# EAGLE schematic RoboSim_top_level (EAGLE 7.3.0)
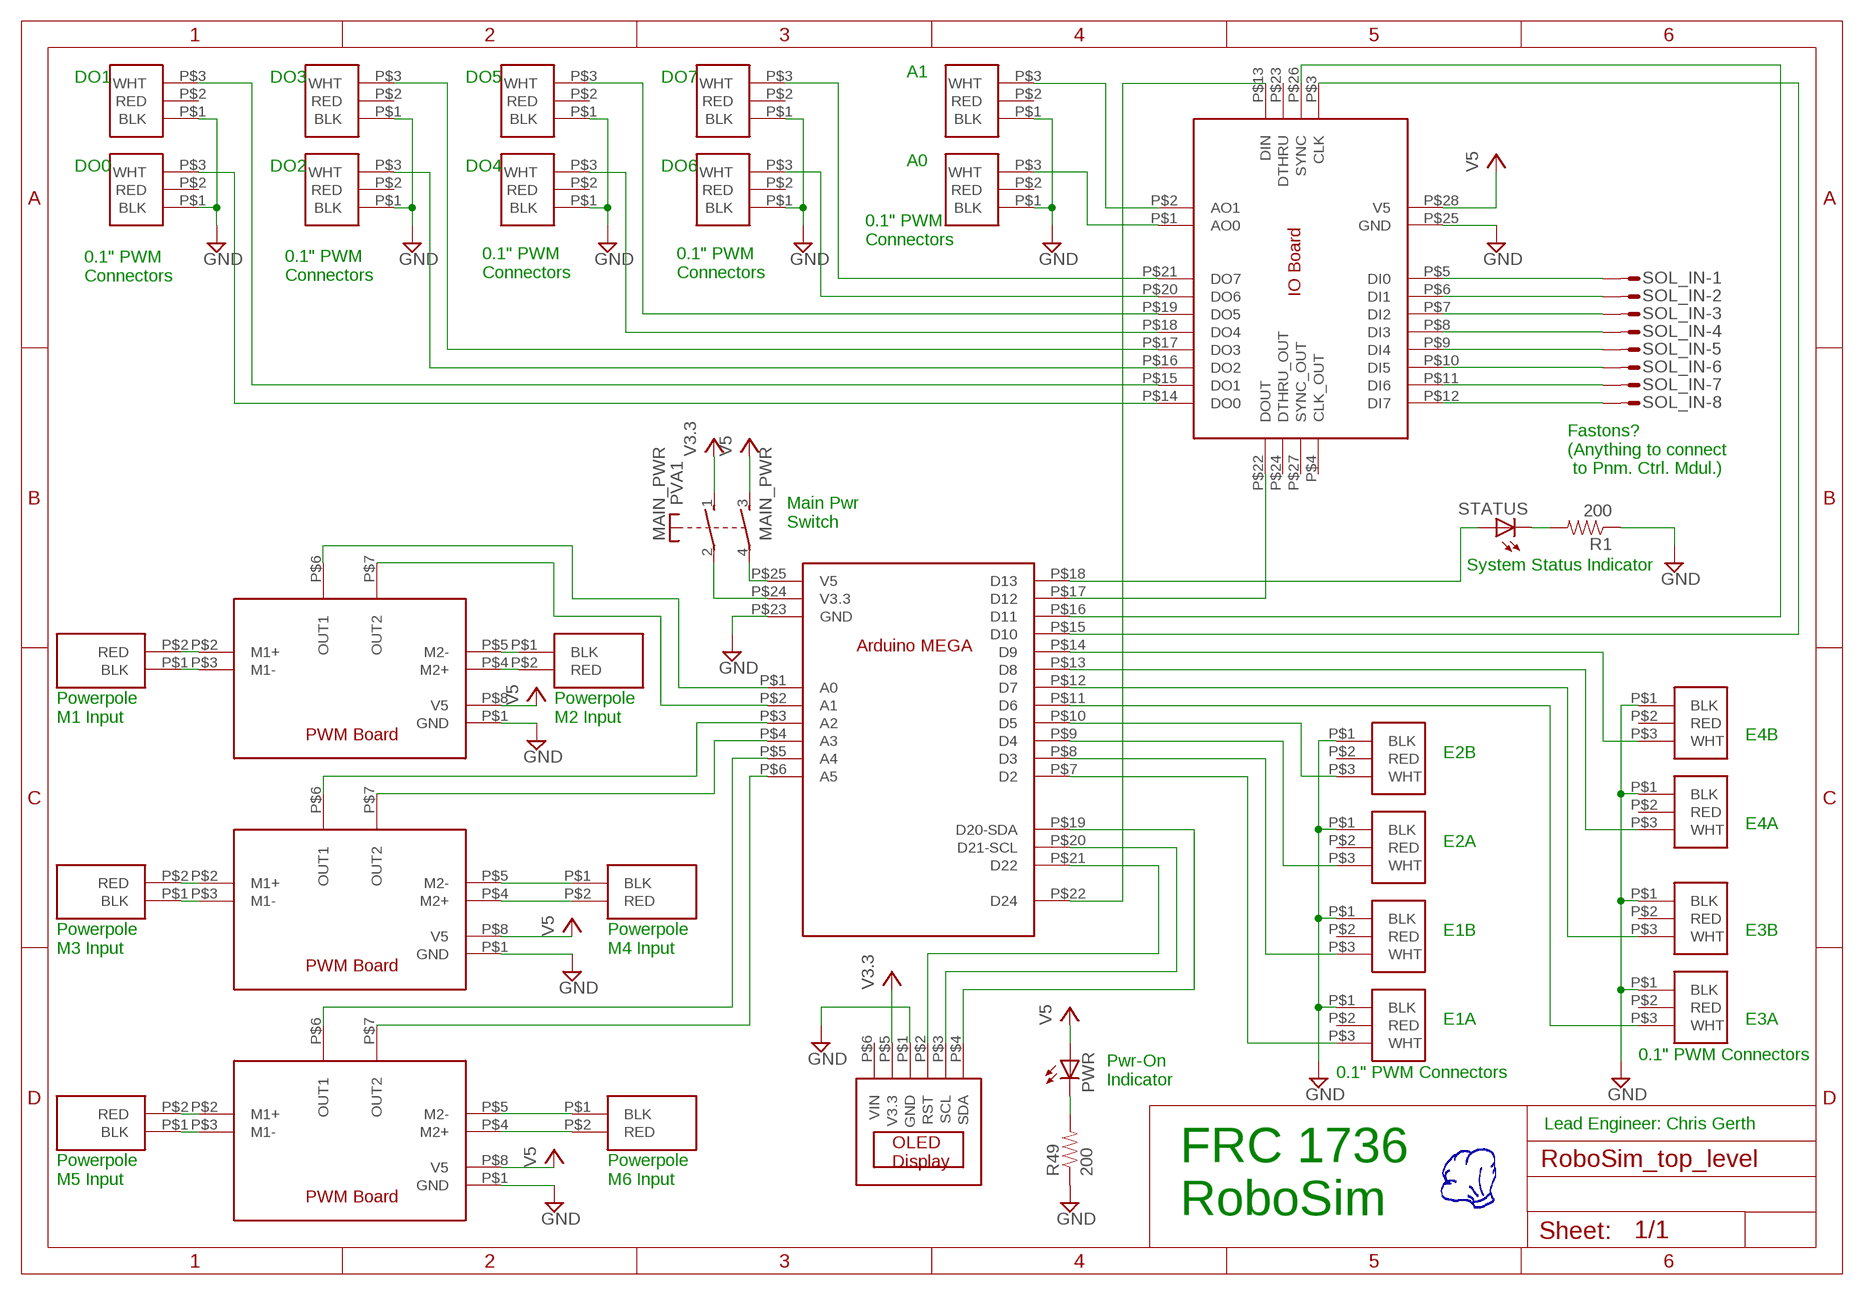
[diagram p0: schematic, sheet 1]

## Parts
MAIN_PWR  PVA1  [PVA1F]
PWR  LED5MM  [LED5MM]
R1  200  RESISTORPTH-1/4W-VERT  [AXIAL-0.1]
R49  200  RESISTORPTH-1/4W-VERT  [AXIAL-0.1]
SOL_IN  MT6-8  [MT6-8]
STATUS  LED5MM  [LED5MM]
U$1  ARDUINO_MEGA  [DUMMY]
U$2  DISPLAY  [DUMMY]
U$3  IO_BOARD  [DUMMY]
U$4  PWM_BOARD  [DUMMY]
U$5  PWM_BOARD  [DUMMY]
U$6  PWM_BOARD  [DUMMY]
U$7  POWERPOLE  [DUMMY]
U$8  POWERPOLE  [DUMMY]
U$9  POWERPOLE  [DUMMY]
U$10  POWERPOLE  [DUMMY]
U$11  POWERPOLE  [DUMMY]
U$12  POWERPOLE  [DUMMY]
U$13  PWM_CONN  [DUMMY]
U$14  PWM_CONN  [DUMMY]
U$15  PWM_CONN  [DUMMY]
U$16  PWM_CONN  [DUMMY]
U$17  PWM_CONN  [DUMMY]
U$18  PWM_CONN  [DUMMY]
U$19  PWM_CONN  [DUMMY]
U$20  PWM_CONN  [DUMMY]
U$21  PWM_CONN  [DUMMY]
U$22  PWM_CONN  [DUMMY]
U$23  PWM_CONN  [DUMMY]
U$24  PWM_CONN  [DUMMY]
U$26  PWM_CONN  [DUMMY]
U$27  PWM_CONN  [DUMMY]
U$28  PWM_CONN  [DUMMY]
U$29  PWM_CONN  [DUMMY]
U$30  PWM_CONN  [DUMMY]
U$31  PWM_CONN  [DUMMY]

## Nets
GND: R1.P$1 R49.P$1 U$1.P$23(GND) U$2.P$1(GND) U$3.P$25(GND) U$4.P$1(GND) U$5.P$1(GND) U$6.P$1(GND) U$13.P$1(BLK) U$14.P$1(BLK) U$15.P$1(BLK) U$16.P$1(BLK) U$17.P$1(BLK) U$18.P$1(BLK) U$19.P$1(BLK) U$20.P$1(BLK) U$21.P$1(BLK) U$22.P$1(BLK) U$23.P$1(BLK) U$24.P$1(BLK) U$26.P$1(BLK) U$27.P$1(BLK) U$28.P$1(BLK) U$29.P$1(BLK) U$30.P$1(BLK) U$31.P$1(BLK)
N$1: U$1.P$19(D20-SDA) U$2.P$4(SDA)
N$2: U$1.P$20(D21-SCL) U$2.P$3(SCL)
N$3: U$1.P$21(D22) U$2.P$2(RST)
N$4: MAIN_PWR.4(2:P) U$1.P$25(V5)
N$5: U$1.P$1(A0) U$4.P$6(OUT1)
N$6: MAIN_PWR.2(1:P) U$1.P$24(V3.3)
N$7: U$1.P$2(A1) U$4.P$7(OUT2)
N$8: U$1.P$3(A2) U$5.P$6(OUT1)
N$9: U$1.P$4(A3) U$5.P$7(OUT2)
N$10: U$1.P$5(A4) U$6.P$6(OUT1)
N$11: U$1.P$6(A5) U$6.P$7(OUT2)
N$12: R1.P$2 STATUS.K(C)
N$13: STATUS.A U$1.P$18(D13)
N$14: U$1.P$22(D24) U$3.P$13(DIN)
N$15: U$1.P$17(D12) U$3.P$22(DOUT)
N$16: U$1.P$16(D11) U$3.P$26(SYNC)
N$17: U$1.P$15(D10) U$3.P$3(CLK)
N$18: U$4.P$3(M1-) U$9.P$1(BLK)
N$19: U$4.P$2(M1+) U$9.P$2(RED)
N$20: U$4.P$5(M2-) U$10.P$1(BLK)
N$21: U$4.P$4(M2+) U$10.P$2(RED)
N$22: U$5.P$5(M2-) U$11.P$1(BLK)
N$23: U$5.P$4(M2+) U$11.P$2(RED)
N$24: U$5.P$3(M1-) U$8.P$1(BLK)
N$25: U$5.P$2(M1+) U$8.P$2(RED)
N$26: U$6.P$5(M2-) U$12.P$1(BLK)
N$27: U$6.P$4(M2+) U$12.P$2(RED)
N$28: U$6.P$3(M1-) U$7.P$1(BLK)
N$29: U$6.P$2(M1+) U$7.P$2(RED)
N$30: U$1.P$7(D2) U$17.P$3(WHT)
N$31: U$1.P$8(D3) U$16.P$3(WHT)
N$32: U$1.P$9(D4) U$15.P$3(WHT)
N$33: U$1.P$10(D5) U$14.P$3(WHT)
N$34: U$1.P$11(D6) U$19.P$3(WHT)
N$35: U$1.P$12(D7) U$18.P$3(WHT)
N$36: U$1.P$13(D8) U$20.P$3(WHT)
N$37: U$1.P$14(D9) U$13.P$3(WHT)
N$38: U$3.P$1(AO0) U$21.P$3(WHT)
N$39: U$3.P$21(DO7) U$23.P$3(WHT)
N$40: U$3.P$2(AO1) U$22.P$3(WHT)
N$41: U$3.P$20(DO6) U$24.P$3(WHT)
N$42: U$3.P$19(DO5) U$26.P$3(WHT)
N$43: U$3.P$18(DO4) U$27.P$3(WHT)
N$44: U$3.P$17(DO3) U$28.P$3(WHT)
N$45: U$3.P$16(DO2) U$29.P$3(WHT)
N$46: U$3.P$15(DO1) U$30.P$3(WHT)
N$47: U$3.P$14(DO0) U$31.P$3(WHT)
N$48: SOL_IN.1 U$3.P$5(DI0)
N$49: SOL_IN.2 U$3.P$6(DI1)
N$50: SOL_IN.3 U$3.P$7(DI2)
N$51: SOL_IN.4 U$3.P$8(DI3)
N$52: SOL_IN.5 U$3.P$9(DI4)
N$53: SOL_IN.6 U$3.P$10(DI5)
N$54: SOL_IN.7 U$3.P$11(DI6)
N$55: SOL_IN.8 U$3.P$12(DI7)
N$61: PWR.K(C) R49.P$2
VCC: MAIN_PWR.1(1:S) MAIN_PWR.3(2:S) PWR.A U$2.P$5(V3.3) U$3.P$28(V5) U$4.P$8(V5) U$5.P$8(V5) U$6.P$8(V5) ; supply symbol labelled V5, V3.3
Unconnected: U$2.P$6(VIN) U$3.P$4(CLK_OUT) U$3.P$23(DTHRU) U$3.P$24(DTHRU_OUT) U$3.P$27(SYNC_OUT) U$13.P$2(RED) U$14.P$2(RED) U$15.P$2(RED) U$16.P$2(RED) U$17.P$2(RED) U$18.P$2(RED) U$19.P$2(RED) U$20.P$2(RED) U$21.P$2(RED) U$22.P$2(RED) U$23.P$2(RED) U$24.P$2(RED) U$26.P$2(RED) U$27.P$2(RED) U$28.P$2(RED) U$29.P$2(RED) U$30.P$2(RED) U$31.P$2(RED)

## Notes on the sheet
- A1
- DO1 | DO3 | DO5 | DO7
- A0
- DO0 | DO2 | DO4 | DO6
- 0.1" PWM
  Connectors
- 0.1" PWM
  Connectors
- 0.1" PWM
  Connectors
- 0.1" PWM
  Connectors
- 0.1" PWM
  Connectors
- Fastons?
  (Anything to connect
   to Pnm. Ctrl. Mdul.)
- Main Pwr
  Switch
- System Status Indicator
- Powerpole
  M1 Input
- Powerpole
  M2 Input
- E4B
- E2B
- E4A
- E2A
- E1B | E3B
- Powerpole
  M3 Input
- Powerpole
  M4 Input
- E1A | E3A
- 0.1" PWM Connectors
- 0.1" PWM Connectors
- Pwr-On
  Indicator
- Lead Engineer: Chris Gerth
- Powerpole
  M5 Input
- Powerpole
  M6 Input
- FRC 1736
  RoboSim
- B:/Projects/RobotCasserole/RoboSim/Eagle/RoboSim/hat.bmp

## Library data of the parts
MAIN_PWR = switch-misc:PVA1: ITT SWITCH
PWR STATUS = SparkFun-LED:LED: LEDs Standard schematic elements and footprints for 5mm, 3mm, 1206, and 0603 sized LEDs. 5mm - Spark Fun Electronics SKU : COM-00529 (and others)
R1 R49 = SparkFun-Resistors:RESISTOR: Resistor Basic schematic elements and footprints for 0603, 1206, and PTH resistors.
SOL_IN = con-amp-mt6:MT6-8: AMP MT6 CONNECTOR; OC_FARNELL: unknown; OC_NEWARK: unknown
U$1 = roboSim_Parts:ARDUINO_MEGA
U$2 = roboSim_Parts:DISPLAY
U$3 = roboSim_Parts:IO_BOARD
U$4-U$6 = roboSim_Parts:PWM_BOARD
U$7-U$12 = roboSim_Parts:POWERPOLE
U$13-U$24 U$26-U$31 = roboSim_Parts:PWM_CONN

## Net classes
0 default: width 0.61 mm, clearance 0.508 mm
1 Clk: width 0.61 mm, clearance 2.515 mm to class 0, clearance 0.508 mm
2 Data: width 0.61 mm, clearance 0.508 mm to class 0, clearance 2.515 mm to class 1, clearance 0.508 mm
3 Sync: width 0.61 mm, clearance 0.508 mm to class 0, clearance 2.515 mm to class 1, clearance 0.508 mm to class 2, clearance 0.508 mm